# EAGLE schematic MultiDrop (EAGLE 7.6.0)
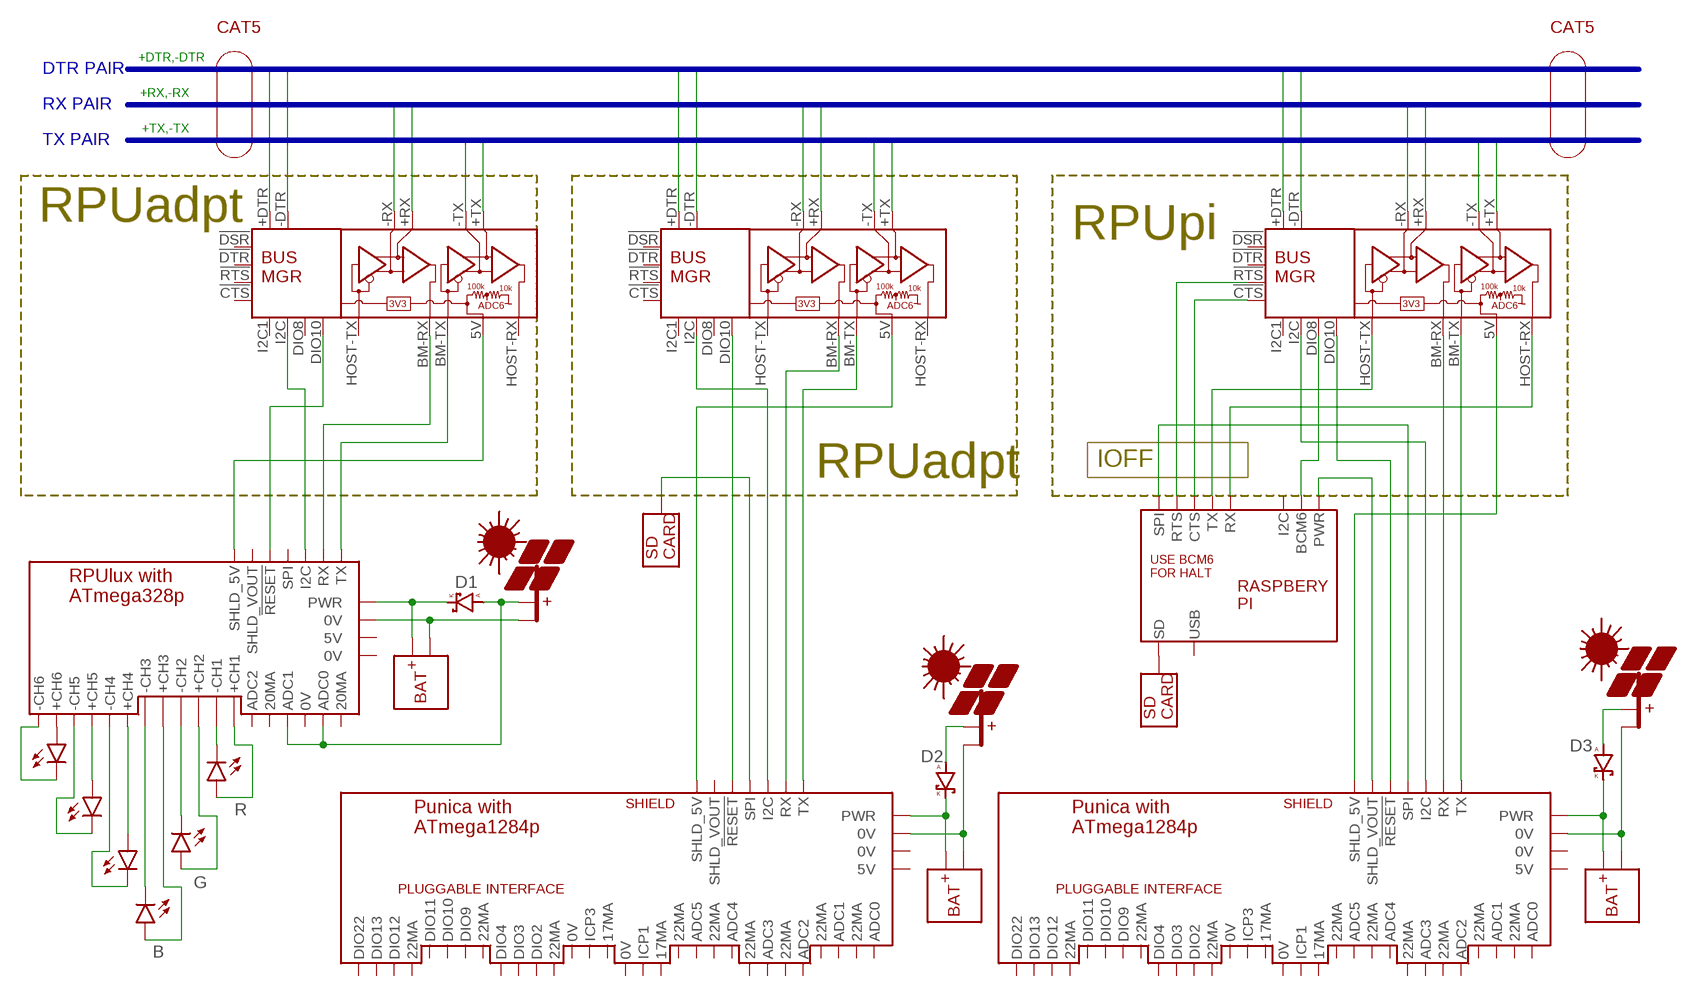
[diagram p0: schematic, sheet 1]

## Parts
B  LED5MM  [LED5MM]
BL2  LED5MM  [LED5MM]
D1  DSMB  [SMB]
D2  DSMB  [SMB]
D3  DSMB  [SMB]
G  LED5MM  [LED5MM]
GN2  LED5MM  [LED5MM]
PV1  PV  [NA-30]
PV2  PV  [NA-30]
PV4  PV  [NA-30]
R  LED5MM  [LED5MM]
RD2  LED5MM  [LED5MM]
SD1  SD  [NA-30]
SD2  SD  [NA-30]
U$1  BUS_MGR  [WITH_RPU_NAMES]
U$2  BUS_MGR  [WITH_RPU_NAMES]
U$3  PI  [NA-30]
U$4  BUS_MGR  [WITH_RPU_NAMES]
U$5  PUNICA  [WITH_RPU_NAMES]
U$6  RPULUX  [WITH_RPU_NAMES]
U$7  BAT  [NA-30]
U$8  PUNICA  [WITH_RPU_NAMES]
U$9  BAT  [NA-30]
U$10  BAT  [NA-30]

## Nets
+DTR: U$4.+DTR
+DTR1: U$2.+DTR
+DTR3: U$1.+DTR
+RX: U$4.+RX
+RX1: U$2.+RX
+RX3: U$1.+RX
+TX: U$4.+TX
+TX1: U$2.+TX
+TX3: U$1.+TX
-DTR: U$4.-DTR
-DTR1: U$2.-DTR
-DTR3: U$1.-DTR
-RX: U$4.-RX
-RX1: U$2.-RX
-RX3: U$1.-RX
-TX: U$4.-TX
-TX1: U$2.-TX
-TX3: U$1.-TX
N$1: U$4.BM-TX(BM_TX) U$6.TX
N$2: U$4.BM-RX(BM_RX) U$6.RX
N$3: D1.A PV1.1(+PV) U$6.ADC0 U$6.ADC1
N$4: D1.K U$6.PWR U$10.1(+BAT)
N$5: R.K U$6.-CH1
N$6: R.A U$6.+CH1
N$7: G.A U$6.+CH2
N$8: G.K U$6.-CH2
N$9: B.A U$6.+CH3
N$10: U$2.BM-TX(BM_TX) U$5.TX
N$11: U$2.BM-RX(BM_RX) U$5.RX
N$12: U$1.DIO8 U$3.7(BCM6)
N$13: U$1.5V(PWR) U$8.SHLD_5V
N$14: U$1.BM-TX(BM_TX) U$8.TX
N$15: D3.K U$7.1(+BAT) U$8.PWR
N$16: D3.A PV4.1(+PV)
N$17: D2.A PV2.1(+PV)
N$18: D2.K U$5.PWR U$9.1(+BAT)
N$19: SD1.1(PV_PWR) U$5.SPI
N$20: B.K U$6.-CH3
N$21: U$1.BM-RX(BM_RX) U$8.RX
N$22: U$1.!CTS U$3.1(CTS)
N$23: U$1.!RTS U$3.2(RTS)
N$24: RD2.A U$6.+CH4
N$25: U$3.10(SPI) U$8.SPI
N$26: U$1.HOST-RX(HOST_RX) U$3.3(RX)
N$27: U$1.HOST-TX(HOST_TX) U$3.4(TX)
N$28: SD2.1(PV_PWR) U$3.9(SD)
N$29: U$4.5V(PWR) U$6.SHLD_5V
N$30: U$4.DIO10 U$6.!RESET
N$31: RD2.K U$6.-CH4
N$32: U$1.I2C U$8.I2C
N$33: U$4.I2C U$6.I2C
N$34: BL2.A U$6.+CH5
N$35: BL2.K U$6.-CH5
N$36: GN2.A U$6.+CH6
N$37: GN2.K U$6.-CH6
N$38: PV1.2(-PV) U$6.0V@PWR(0V) U$10.2(-BAT)
N$39: PV2.2(-PV) U$5.0V@PWR(0V) U$9.2(-BAT)
N$41: U$3.12(PWR) U$8.SHLD_VOUT
N$42: PV4.2(-PV) U$7.2(-BAT) U$8.0V@PWR(0V)
N$43: U$1.DIO10 U$8.!RESET
N$44: U$2.DIO10 U$5.!RESET
N$45: U$2.5V(PWR) U$5.SHLD_5V
N$48: U$2.I2C U$5.I2C
Unconnected: U$1.!DSR U$1.!DTR U$1.I2C1 U$2.!CTS U$2.!DSR U$2.!DTR U$2.!RTS U$2.DIO8 U$2.HOST-RX(HOST_RX) U$2.HOST-TX(HOST_TX) U$2.I2C1 U$3.8(I2C) U$3.11(USB) U$4.!CTS U$4.!DSR U$4.!DTR U$4.!RTS U$4.DIO8 U$4.HOST-RX(HOST_RX) U$4.HOST-TX(HOST_TX) U$4.I2C1 U$5.0V U$5.0V@ICP1(0V) U$5.0V@ICP3(0V) U$5.5V U$5.17MA@ICP1(17MA) U$5.17MA@ICP3(17MA) U$5.22MA@ADC0(22MA) U$5.22MA@ADC1(22MA) U$5.22MA@ADC2(22MA) U$5.22MA@ADC3(22MA) U$5.22MA@ADC4(22MA) U$5.22MA@ADC5(22MA) U$5.22MA@DIO2(22MA) U$5.22MA@DIO9(22MA) U$5.22MA@DIO12(22MA) U$5.ADC0 U$5.ADC1 U$5.ADC2 U$5.ADC3 U$5.ADC4 U$5.ADC5 U$5.DIO2 U$5.DIO3 U$5.DIO4 U$5.DIO9 U$5.DIO10 U$5.DIO11 U$5.DIO12 U$5.DIO13 U$5.DIO22 U$5.ICP1 U$5.ICP3 U$5.SHLD_VOUT U$6.0V U$6.0V@DIO2(0V) U$6.5V U$6.22MA@ADC0(20MA) U$6.22MA@ADC1(20MA) U$6.ADC2 U$6.SHLD_VOUT U$6.SPI U$8.0V U$8.0V@ICP1(0V) U$8.0V@ICP3(0V) U$8.5V U$8.17MA@ICP1(17MA) U$8.17MA@ICP3(17MA) U$8.22MA@ADC0(22MA) U$8.22MA@ADC1(22MA) U$8.22MA@ADC2(22MA) U$8.22MA@ADC3(22MA) U$8.22MA@ADC4(22MA) U$8.22MA@ADC5(22MA) U$8.22MA@DIO2(22MA) U$8.22MA@DIO9(22MA) U$8.22MA@DIO12(22MA) U$8.ADC0 U$8.ADC1 U$8.ADC2 U$8.ADC3 U$8.ADC4 U$8.ADC5 U$8.DIO2 U$8.DIO3 U$8.DIO4 U$8.DIO9 U$8.DIO10 U$8.DIO11 U$8.DIO12 U$8.DIO13 U$8.DIO22 U$8.ICP1 U$8.ICP3

## Buses
+DTR,-DTR
+RX,-RX
+TX,-TX

## Notes on the sheet
- CAT5 | CAT5
- DTR PAIR
- RX PAIR
- TX PAIR
- RPUadpt
- RPUpi
- IOFF
- RPUadpt

## Library data of the parts
B BL2 G GN2 R RD2 = D-LED:LED: LED 120120WH [CREE,XHGAWT-00-0000-00000HXE1] LED WHITE 6500K 150LUM-W120120
D1-D3 = D-SBR:D: DIODE
PV1 PV2 PV4 = Documentation:PV
SD1 SD2 = Documentation:SD
U$1 U$2 U$4 = Documentation:BUS_MGR: RPU BUS MANAGER
U$3 = Documentation:PI: Raspbery Pi
U$5 U$8 = Documentation:PUNICA
U$6 = Documentation:RPULUX
U$7 U$9 U$10 = Documentation:BAT